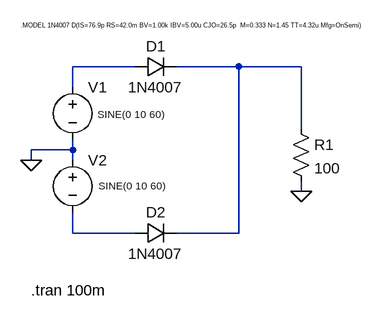
[diagram p0: schematic Retificador Onda Completa com CT.asc]
Retificador Onda Completa com CT.asc, the LTspice schematic file:
Version 4
SHEET 1 1124 680
WIRE 112 32 16 32
WIRE 272 32 176 32
WIRE 368 32 272 32
WIRE 16 64 16 32
WIRE 368 128 368 32
WIRE 16 160 16 144
WIRE 16 160 -48 160
WIRE -48 176 -48 160
WIRE 16 176 16 160
WIRE 368 224 368 208
WIRE 16 288 16 256
WIRE 112 288 16 288
WIRE 272 288 272 32
WIRE 272 288 176 288
FLAG 368 224 0
FLAG -48 176 0
SYMBOL voltage 16 48 R0
WINDOW 3 38 57 Left 1
WINDOW 123 0 0 Left 0
WINDOW 39 0 0 Left 0
SYMATTR Value SINE(0 10 60)
SYMATTR InstName V1
SYMBOL voltage 16 160 R0
WINDOW 3 40 55 Left 1
WINDOW 123 0 0 Left 0
WINDOW 39 0 0 Left 0
SYMATTR Value SINE(0 10 60)
SYMATTR InstName V2
SYMBOL diode 112 48 R270
WINDOW 0 32 32 VTop 2
WINDOW 3 0 32 VBottom 2
SYMATTR InstName D1
SYMATTR Value 1N4007
SYMBOL diode 112 304 R270
WINDOW 0 32 32 VTop 2
WINDOW 3 0 32 VBottom 2
SYMATTR InstName D2
SYMATTR Value 1N4007
SYMBOL res 352 112 R0
SYMATTR InstName R1
SYMATTR Value 100
TEXT -48 376 Left 2 !.tran 100m
TEXT -64 -32 Left 0 !.MODEL 1N4007 D(IS=76.9p RS=42.0m BV=1.00k IBV=5.00u CJO=26.5p  M=0.333 N=1.45 TT=4.32u Mfg=OnSemi)

The netlist it stands for:
* Retificador Onda Completa com CT.asc
V1 N001 0 SINE(0 10 60)
V2 0 N003 SINE(0 10 60)
D1 N001 N002 1N4007
D2 N003 N002 1N4007
R1 N002 0 100
.model D D
.lib standard.dio
.tran 100m
.MODEL 1N4007 D(IS=76.9p RS=42.0m BV=1.00k IBV=5.00u CJO=26.5p  M=0.333 N=1.45 TT=4.32u Mfg=OnSemi)
.backanno
.end